# Altium schematic sheet RTC-Power-Eth.SchDoc
size A4; SheetNumber: 3; SheetTotal: 3
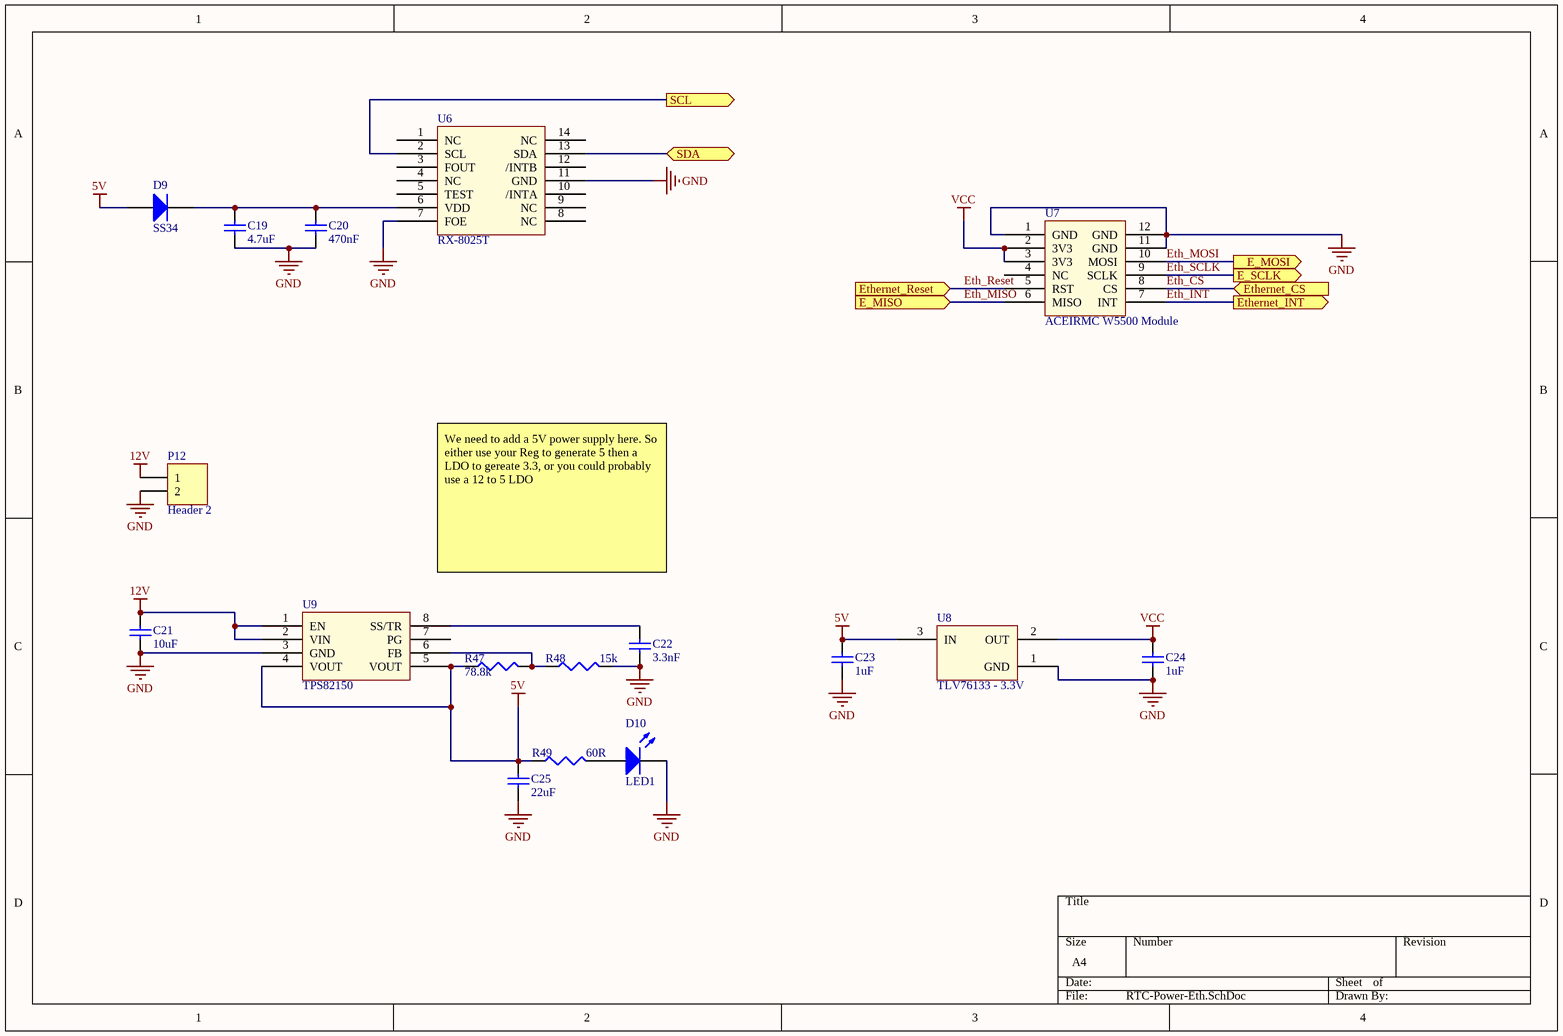
[diagram p0: RTC-Power-Eth.SchDoc]

## Parts
C19  value 4.7uF  [CAPC2012X04M]  (hidden comment: Cap)
C20  value 470nF  [CAPC2012X04M]  (hidden comment: Cap)
C21  value 10uF  [CAPC2012X04M]  (hidden comment: Cap)
C22  value 3.3nF  [CAPC2012X04M]  (hidden comment: Cap)
C23  value 1uF  [CAPC2012X04M]  (hidden comment: Cap)
C24  value 1uF  [CAPC2012X04M]  (hidden comment: Cap)
C25  value 22uF  [CAPC2012X04M]  (hidden comment: Cap)
D9  SS34  [DIOC2012X04M]
D10  LED1  [DIOC2012X04M]
P12  Header 2  [WURTH- WR-TBL 2pin 5mmpitch]
R47  value 78.8k  [RESC2012X04M]  (hidden comment: Res3)
R48  value 15k  [RESC2012X04M]  (hidden comment: Res3)
R49  value 60R  [RESC2012X04M]  (hidden comment: Res3)
U6  RX-8025T  [SOP127P740X320-14N]
U7  ACEIRMC W5500 Module  [W5500Module]
U8  TLV76133 - 3.3V  [SOT230P700X180-4N]
U9  TPS82150  [TPS82150SIL]

## Ports
E_MISO (in), E_MOSI (out), E_SCLK (out), Ethernet_CS (in), Ethernet_INT (out), Ethernet_Reset (in), SCL (out), SDA (bidir)

## Nets
5V: C23.1 C25.1 D9.1(A) R47.1 R49.1 U8.3(IN) U9.4(VOUT) U9.5(VOUT)
12V: C21.1 P12.1 U9.1(EN) U9.2(VIN)
GND: C19.2 C20.2 C21.2 C22.2 C23.2 C24.2 C25.2 D10.2(K) P12.2 R48.2 U6.7(FOE) U6.11(GND) U7.1(GND) U7.11(GND) U7.12(GND) U8.1(GND) U9.3(GND)
VCC: C24.1 U7.2(3V3) U7.3(3V3) U8.2(OUT)
Eth_CS: U7.8(CS) ; port Ethernet_CS
Eth_INT: U7.7(INT) ; port Ethernet_INT
Eth_MISO: U7.6(MISO) ; port E_MISO
Eth_MOSI: U7.10(MOSI) ; port E_MOSI
Eth_Reset: U7.5(RST) ; port Ethernet_Reset
Eth_SCLK: U7.9(SCLK) ; port E_SCLK
SCL: U6.2(SCL) ; port SCL
SDA: U6.13(SDA) ; port SDA
NetC19_1: C19.1 C20.1 D9.2(K) U6.6(VDD)
NetC22_1: C22.1 U9.8(SS/TR)
NetD10_1: D10.1(A) R49.2
NetR47_2: R47.2 R48.1 U9.6(FB)

Not connected (* = marked no-connect by the designer): U6 1(NC) 3(FOUT) 4(NC) 5(TEST) 8(NC) 9(NC) 10(/INTA) 12(/INTB) 14(NC); U7 4(NC); U9 7(PG)

## Notes on the sheet
- We need to add a 5V power supply here. So either use your Reg to generate 5 then a LDO to gereate 3.3, or you could probably use a 12 to 5 LDO

## Library data of the parts
C19-C25 = Cap: Capacitor; Published: 8-Jun-2000; LatestRevisionDate: 17-Jul-2002; LatestRevisionNote: Re-released for DXP Platform.; PackageReference: RAD-0.3; Publisher: Altium Limited; PackageDescription: Radial Cap, Thru-Hole; 2 Leads; 0.3 in Pin Spacing
D9 = Diode: Default Diode; Published: 8-Jun-2000; LatestRevisionDate: 17-Jul-2002; LatestRevisionNote: Re-released for DXP Platform.; PackageVersion: Sep-1996; PackageReference: SMC; Publisher: Altium Limited; PackageDescription: DO-214-AB/SMC; 2 C-Bend Leads; Body 7.9 x 5.9 mm, inc. leads (LxW); Code_JEDEC: DO-214-AB
D10 = LED1: Typical RED GaAs LED; Published: 8-Jun-2000; LatestRevisionDate: 08-Jul-2005; LatestRevisionNote: Mech Layer 1 removed.; PackageReference: LED-1; Publisher: Altium Limited; PackageDescription: LED; 2 Leads
P12 = Header 2: Header, 2-Pin; LatestRevisionDate: 17-Jul-2002; LatestRevisionNote: Re-released for DXP Platform.; Publisher: Altium Limited
R47-R49 = Res3: Resistor; Published: 8-Jun-2000; LatestRevisionDate: 29-May-2009; LatestRevisionNote: IPC-7351 Footprint Added.; PackageReference: J1-0603; Publisher: Altium Limited; PackageDescription: Chip Resistor
U8 = Generic LDO